# EAGLE design scales (EAGLE 7.3.0)
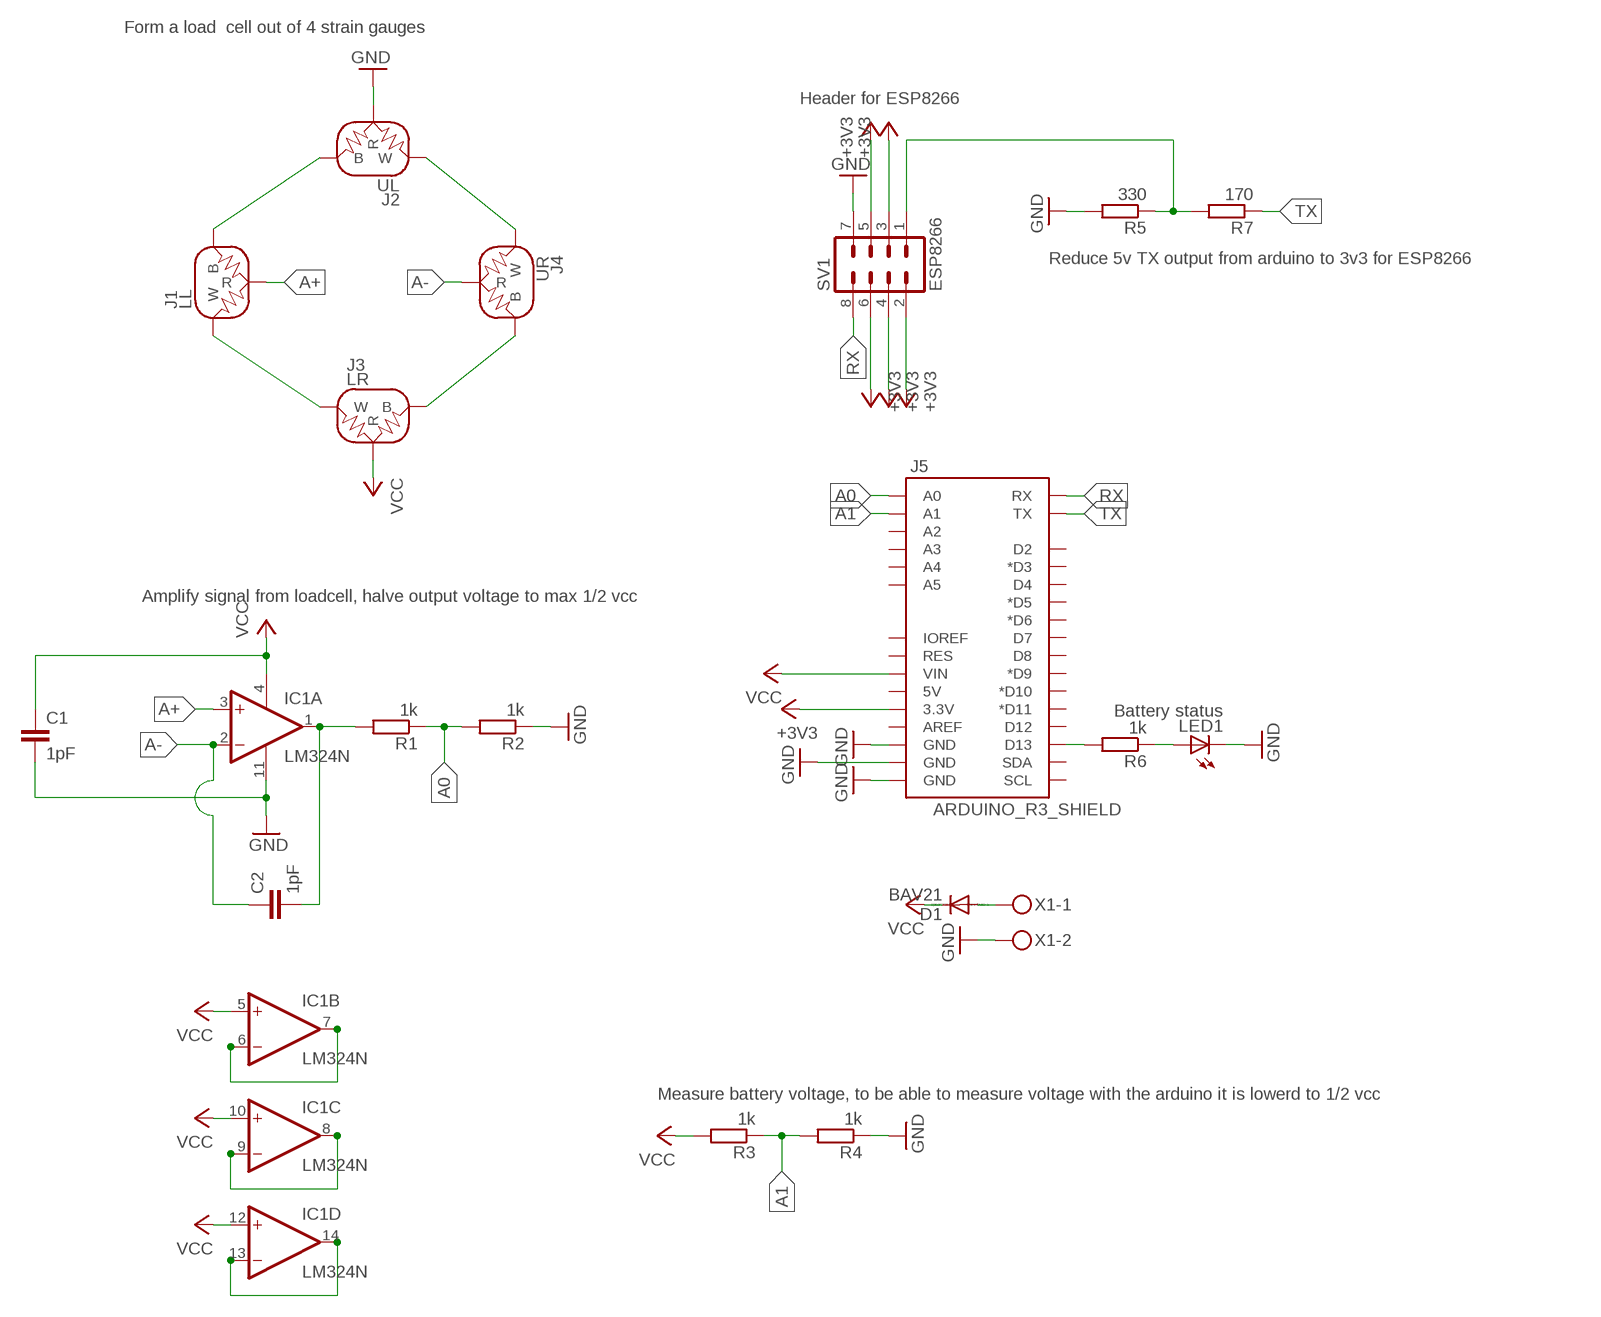
[diagram p0: schematic, sheet 1]

## Parts
C1  1pF  C-EU025-024X044  [C025-024X044]
C2  1pF  C-EU025-024X044  [C025-024X044]
D1  BAV21  [DO35-10]
IC1  LM324N  [DIL14]
J1  LL  LOAD_CELL1X03-PTH  [1X03]
J2  UL  LOAD_CELL1X03-PTH  [1X03]
J3  LR  LOAD_CELL1X03-PTH  [1X03]
J4  UR  LOAD_CELL1X03-PTH  [1X03]
J5  ARDUINO_R3_SHIELD  [UNO_R3_SHIELD]
LED1  Battery status  LED5MM  [LED5MM]
R1  1k  R-EU_0204/5  [0204/5]
R2  1k  R-EU_0204/5  [0204/5]
R3  1k  R-EU_0204/5  [0204/5]
R4  1k  R-EU_0204/5  [0204/5]
R5  330  R-EU_0204/5  [0204/5]
R6  1k  R-EU_0204/5  [0204/5]
R7  170  R-EU_0204/5  [0204/5]
SV1  ESP8266  MA04-2  [MA04-2]
X1  MKDSN1,5/2-5,08  [MKDSN1,5/2-5,08]

## Nets
+3V3: J5.3.3V SV1.2 SV1.3 SV1.4 SV1.5 SV1.6
A0: J5.A0 R1.1 R2.2
A1: J5.A1 R3.1 R4.2
A+: IC1.3(A:+IN) J1.3(R)
A-: C2.1 IC1.2(A:-IN) J4.3(R)
GND: C1.2 IC1.11(P:V-) J2.3(R) J5.GND@0(GND) J5.GND@1(GND) J5.GND@2(GND) LED1.K(C) R2.1 R4.1 R5.2 SV1.7 X1.2
N$1: IC1.6(B:-IN) IC1.7(B:OUT)
N$2: IC1.8(C:OUT) IC1.9(C:-IN)
N$3: IC1.13(D:-IN) IC1.14(D:OUT)
N$4: D1.A X1.1
N$5: J5.D13 R6.2
N$6: C2.2 IC1.1(A:OUT) R1.2
N$7: LED1.A R6.1
N$8: R5.1 R7.2 SV1.1
N$13: J1.1(B) J2.1(B)
N$14: J3.1(B) J4.1(B)
N$15: J2.2(W) J4.2(W)
N$16: J1.2(W) J3.2(W)
RX: J5.RX SV1.8
TX: J5.TX R7.1
VCC: C1.1 D1.C IC1.4(P:V+) IC1.5(B:+IN) IC1.10(C:+IN) IC1.12(D:+IN) J3.3(R) J5.VIN R3.2
Unconnected: J5.5V J5.A2 J5.A3 J5.A4 J5.A5 J5.AREF J5.D2 J5.D3(*D3) J5.D4 J5.D5(*D5) J5.D6(*D6) J5.D7 J5.D8 J5.D9(*D9) J5.D10(*D10) J5.D11(*D11) J5.D12 J5.IOREF J5.RES J5.SCL J5.SDA

## Notes on the sheet
- Form a load  cell out of 4 strain gauges
- Header for ESP8266
- Reduce 5v TX output from arduino to 3v3 for ESP8266
- Amplify signal from loadcell, halve output voltage to max 1/2 vcc
- Measure battery voltage, to be able to measure voltage with the arduino it is lowerd to 1/2 vcc

## Library data of the parts
C1 C2 = rcl:C-EU: CAPACITOR, European symbol
D1 = diode:BAV21: DIODE high-voltage general purpose diode
IC1 = linear:LM324: OP AMP; MF: STMICROELECTRONICS; MPN: LM324AN; OC_FARNELL: 1467654
J1-J4 = SparkFun-Sensors:LOAD_CELL: Half-wheatstone bridge Load Cell; OC_FARNELL: unknown
J5 = SparkFun-Boards:ARDUINO_R3_SHIELD: Shield form compatible with the Arduino Uno R3.; OC_FARNELL: unknown
LED1 = led:LED: LED OSRAM: - CHIPLED LG R971, LG N971, LY N971, LG Q971, LY Q971, LO R971, LY R971 LH N974, LH R974 LS Q976, LO Q976, LY Q976 LO Q996 - Hyper CHIPLED LW Q18S LB Q993, LB Q99A, LB R99A - SideLED LS A670, LO A670, LY A670, LG A670, LP A670 LB A673, LV A673, LT A673, LW A673 LH A674 LY A675 LS A676, LA A676, LO A676, LY A676, LW A676 LS A679, LY A679, LG A679 - Hyper Micro SIDELED® LS Y876, LA Y876, LO Y876, LY Y876 LT Y87S - SmartLED LW L88C, LW L88S LB L89C, LB L89S, LG L890 LS L89K, LO L89K, LY L89K LS L896, LA L896, LO L896, LY L896 - TOPLED LS T670, LO T670, LY T670, LG T670, LP T670 LSG T670, LSP T670, LSY T670, LOP T670, LYG T670 LG T671, LOG T671, LSG T671 LB T673, LV T673, LT T673, LW T673 LH T674 LS T676, LA T676, LO T676, LY T676, LB T676, LH T676, LSB T676, LW T676 LB T67C, LV T67C, LT T67C, LS T67K, LO T67K, LY T67K, LW E67C LS E67B, LA E67B, LO E67B, LY E67B, LB E67C, LV E67C, LT E67C LW T67C LS T679, LY T679, LG T679 LS T770, LO T770, LY T770, LG T770, LP T770 LB T773, LV T773, LT T773, LW T773 LH T774 LS E675, LA E675, LY E675, LS T675 LS T776, LA T776, LO T776, LY T776, LB T776 LHGB T686 LT T68C, LB T68C - Hyper Mini TOPLED® LB M676 - Mini TOPLED Santana® LG M470 LS M47K, LO M47K, LY M47K Source: http://www.osram.convergy.de LUXEON: - LUMILED® LXK2-PW12-R00, LXK2-PW12-S00, LXK2-PW14-U00, LXK2-PW14-V00 LXK2-PM12-R00, LXK2-PM12-S00, LXK2-PM14-U00 LXK2-PE12-Q00, LXK2-PE12-R00, LXK2-PE12-S00, LXK2-PE14-T00, LXK2-PE14-U00 LXK2-PB12-K00, LXK2-PB12-L00, LXK2-PB12-M00, LXK2-PB14-N00, LXK2-PB14-P00, LXK2-PB14-Q00 LXK2-PR12-L00, LXK2-PR12-M00, LXK2-PR14-Q00, LXK2-PR14-R00 LXK2-PD12-Q00, LXK2-PD12-R00, LXK2-PD12-S00 LXK2-PH12-R00, LXK2-PH12-S00 LXK2-PL12-P00, LXK2-PL12-Q00, LXK2-PL12-R00 Source: www.luxeon.com KINGBRIGHT: KA-3528ASYC Source: www.kingbright.com
R1-R7 = resistor:R-EU_: RESISTOR, European symbol; MF: PANASONIC ELECTRONIC COMPONENTS; MPN: ERG1SJ102; OC_FARNELL: 2324488
SV1 = con-lstb:MA04-2: PIN HEADER; MF: GLOBAL CONNECTOR TECHNOLOGY; MPN: BD060-08-A-N-0230-L-G; OC_FARNELL: 1798806; OC_NEWARK: unknown
X1 = con-phoenix-508:MKDSN1,5/2-5,08: MKDSN 1,5/ 2-5,08 Printklemme Nennstrom: 13,5 A Nennspannung: 250 V Rastermaß: 5,08 mm Polzahl: 2 Anschlussart: Schraubanschluss Montage: Löten Anschlussrichtung Leiter/Platine: 0 ° Artikelnummer: 1729128 Source: http://eshop.phoenixcontact.com .. 1729128.pdf

## Net classes
0 default: width 0.305 mm, drill 0.508 mm, clearance 0.254 mm

## Board
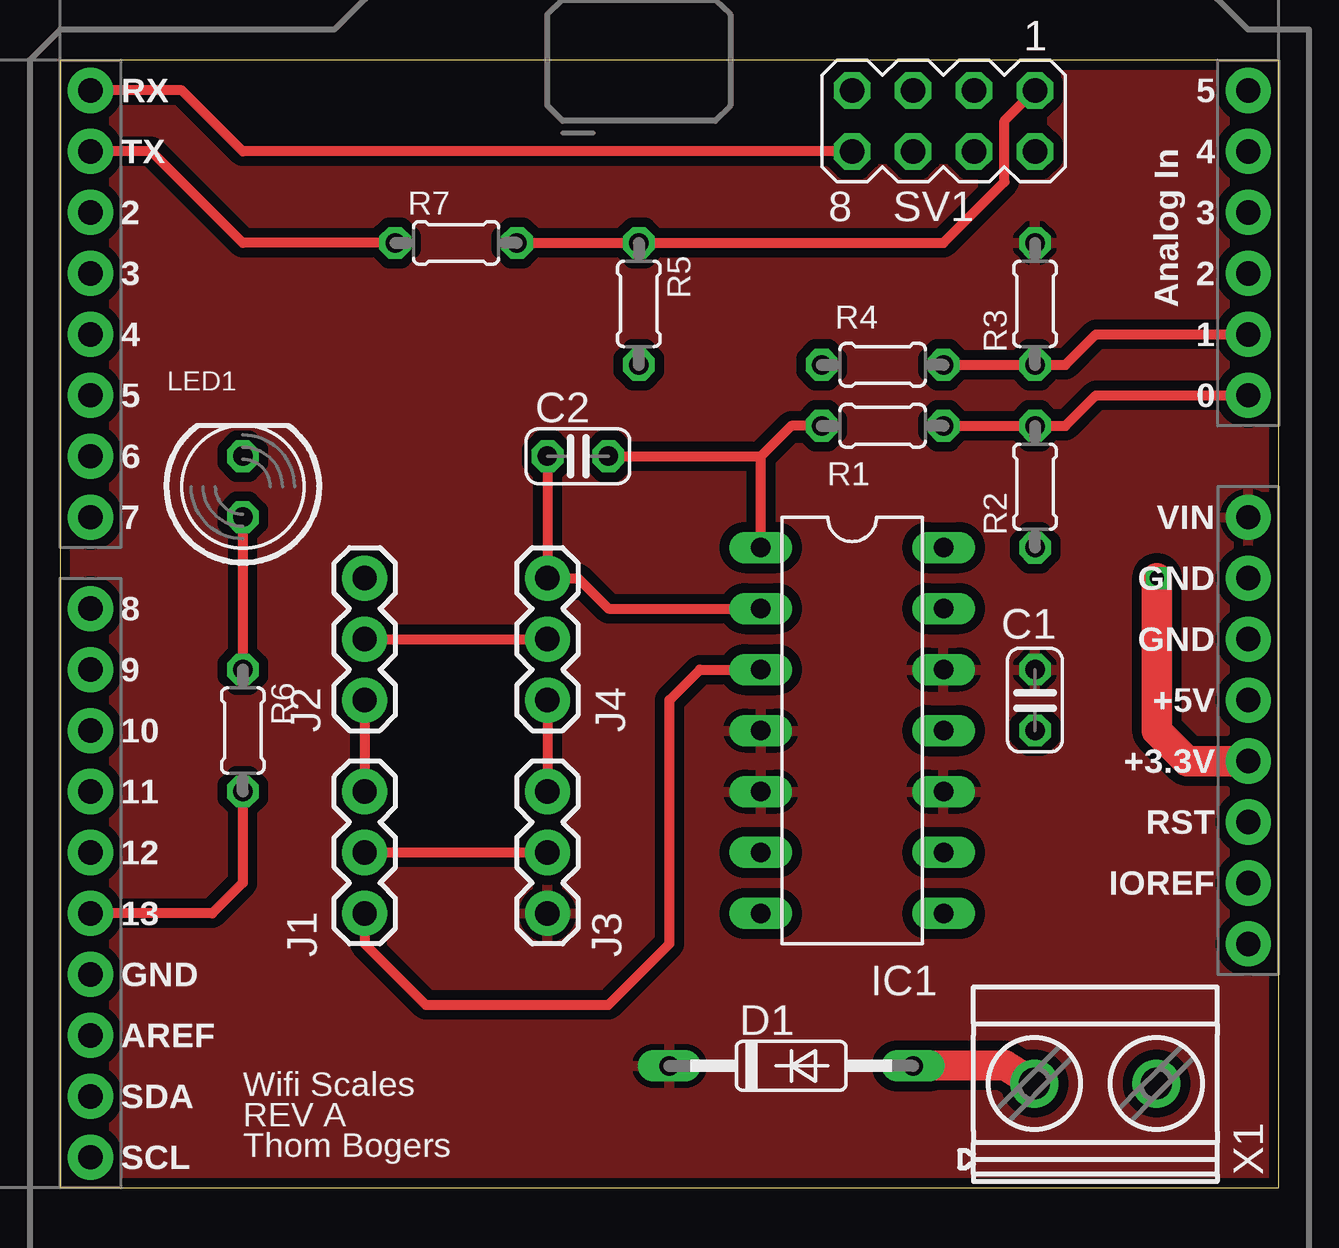
[diagram p1: board, top side]
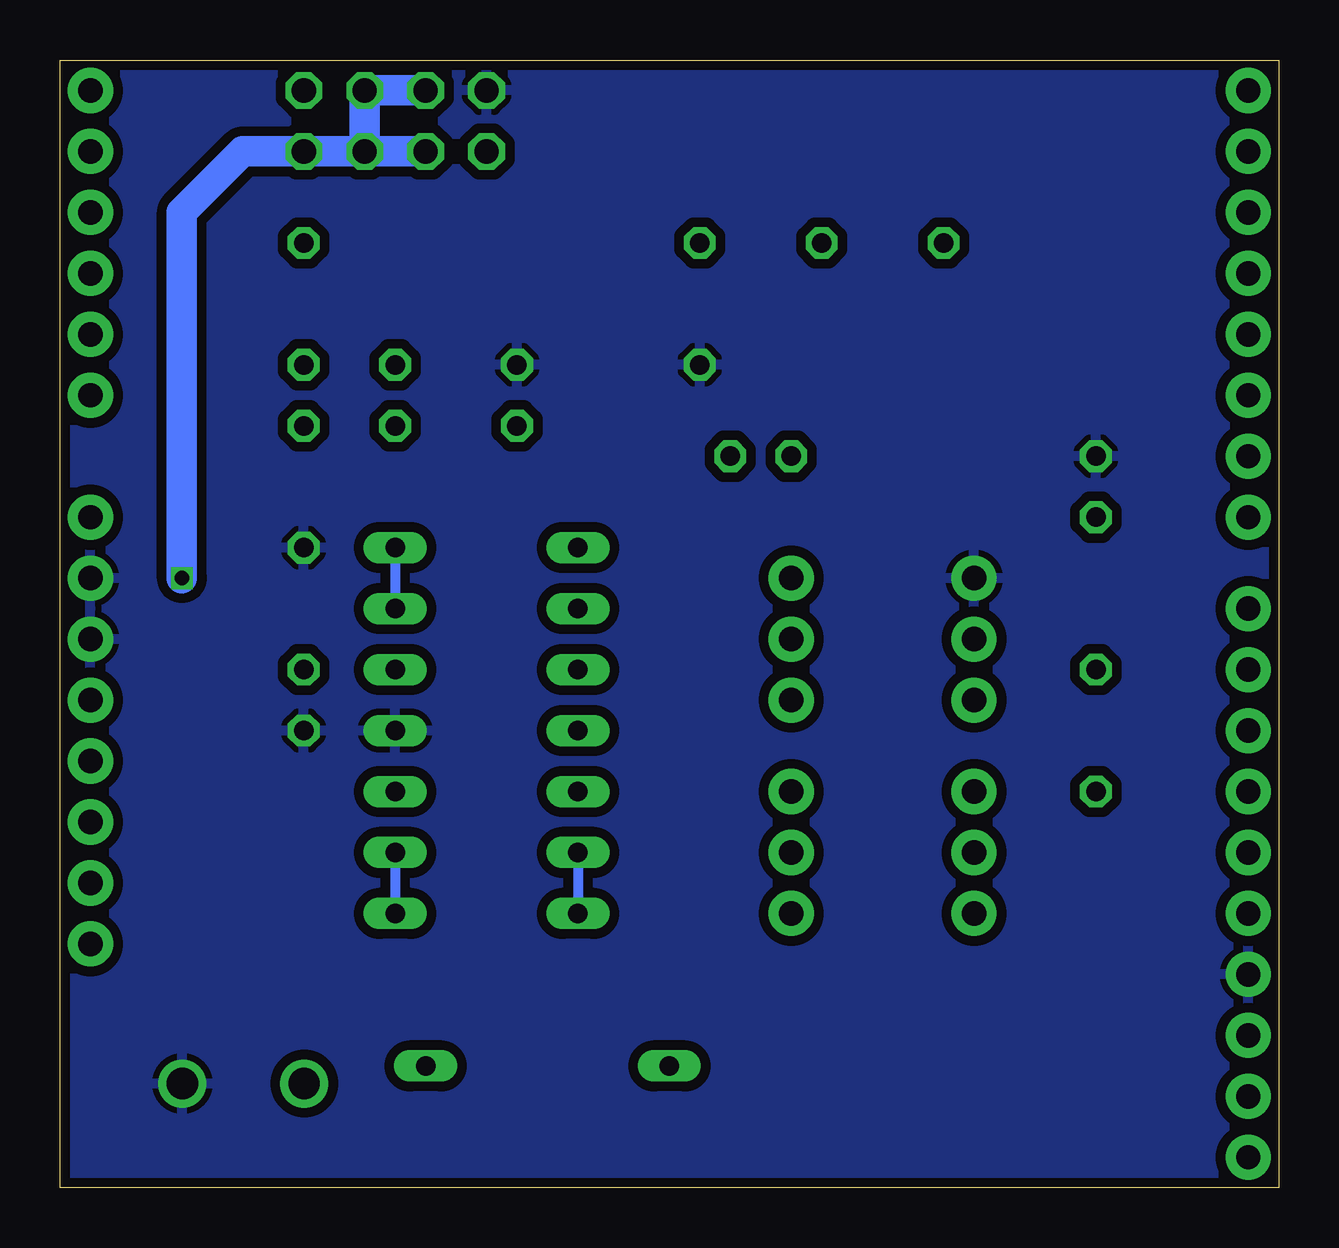
[diagram p2: board, bottom side, seen from below]

Size 50.8 x 46.98 mm. Coordinates in mm from the lower left corner, seen from the top.
Outline: 0,0 50.8,0 50.8,46.98 0,46.98 0,0
Copper layers (1*16): Top 0.035mm / dielectric 1.5mm / Bottom 0.035mm
Design rules "ITead_rule": minimum track width 6mil, minimum drill 12mil, track to track 6mil, track to pad 6mil, pad to pad 6mil, via to via 6mil, smd to smd 0mil, copper to edge 10mil, drill to drill 10mil, minimum pad ring 10mil, minimum via ring 6mil, stop-mask expansion 2mil, vias tented up to drill 100mil, thermal gap 10mil

### Footprints (pad centres in the part's own frame; a part is rotated, then mirrored left to right if it is on the bottom)
C025-024X044 = drill 0.813 octagon: 1 -1.27,0; 2 1.27,0
DO35-10 = drill 0.813 long: A 5.08,0; C -5.08,0
DIL14 = drill 0.813 long: 1 -7.62,-3.81; 2 -5.08,-3.81; 3 -2.54,-3.81; 4 0,-3.81; 5 2.54,-3.81; 6 5.08,-3.81; 7 7.62,-3.81; 8 7.62,3.81; 9 5.08,3.81; 10 2.54,3.81; 11 0,3.81; 12 -2.54,3.81; 13 -5.08,3.81; 14 -7.62,3.81
1X03 = drill 1.016 pad 1.88: 1 0,0; 2 2.54,0; 3 5.08,0
UNO_R3_SHIELD = drill 1.016 pad 1.88: 3.3V 50.8,26.67; 5V 50.8,29.21; A0 50.8,41.91; A1 50.8,44.45; A2 50.8,46.99; A3 50.8,49.53; A4 50.8,52.07; A5 50.8,54.61; AREF 2.54,15.24; D2 2.54,49.53; D3 2.54,46.99; D4 2.54,44.45; D5 2.54,41.91; D6 2.54,39.37; D7 2.54,36.83; D8 2.54,33.02; D9 2.54,30.48; D10 2.54,27.94; D11 2.54,25.4; D12 2.54,22.86; D13 2.54,20.32; GND@0 50.8,31.75; GND@1 50.8,34.29; GND@2 2.54,17.78; IOREF 50.8,21.59; NC 50.8,19.05; RES 50.8,24.13; RX 2.54,54.61; SCL 2.54,10.16; SDA 2.54,12.7; TX 2.54,52.07; VIN 50.8,36.83
LED5MM = drill 0.813 octagon: A -1.27,0; K 1.27,0
0204/5 = drill 0.813 octagon: 1 -2.54,0; 2 2.54,0
MA04-2 = drill 1.016 octagon: 1 -3.81,-1.27; 2 -3.81,1.27; 3 -1.27,-1.27; 4 -1.27,1.27; 5 1.27,-1.27; 6 1.27,1.27; 7 3.81,-1.27; 8 3.81,1.27
MKDSN1,5/2-5,08 = drill 1.3 pad 2: 1 -2.561,0.025; 2 2.519,0.025

### Placement (x,y rotation side)
C1  40.64,20.32 270 top
C2  21.59,30.48 0 top
D1  30.48,5.08 0 top
IC1  33.02,19.05 270 top
J1  12.7,16.51 270 top
J2  12.7,20.32 90 top
J3  20.32,16.51 270 top
J4  20.32,20.32 90 top
J5  -1.27,-8.89 0 top
LED1  7.62,29.21 90 top
R1  34.29,31.75 180 top
R2  40.64,29.21 90 top
R3  40.64,36.83 90 top
R4  34.29,34.29 0 top
R5  24.13,36.83 270 top
R6  7.62,19.05 270 top
R7  16.51,39.37 0 top
SV1  36.83,44.45 180 top
X1  43.18,4.32 0 top

### Tracks (layer width: path | path; a pad name or v marks a point on that pad's centre or on a via)
+3V3  (via drill 0.6)
  Top 1.27: J5.3.3V 46.99,17.78 45.72,19.05 v45.72,25.4
  Bottom 1.27: SV1.4 SV1.6 | SV1.4 SV1.3 SV1.5 | SV1.4 SV1.2 43.18,43.18 45.72,40.64 v45.72,25.4
A0
  Top 0.406: R1.1 R2.2 41.91,31.75 43.18,33.02 J5.A0
A1
  Top 0.406: R4.2 R3.1 41.91,34.29 43.18,35.56 J5.A1
A+
  Top 0.406: J1.3 12.7,10.16 15.24,7.62 22.86,7.62 25.4,10.16 25.4,20.32 26.67,21.59 IC1.3
A-
  Top 0.406: IC1.2 22.86,24.13 21.59,25.4 J4.3 C2.1
GND
  pour Bottom (isolate 0.406): 0,46.99 0,0 50.8,0 50.8,46.99
N$1
  Bottom 0.406: IC1.6 IC1.7
N$2
  Bottom 0.406: IC1.9 IC1.8
N$3
  Bottom 0.406: IC1.14 IC1.13
N$4
  Top 1.27: X1.1 39.39,5.1 D1.A
N$5
  Top 0.406: R6.2 7.62,12.7 6.35,11.43 J5.D13
N$6
  Top 0.406: IC1.1 29.21,30.48 | R1.2 30.48,31.75 29.21,30.48 | C2.2 29.21,30.48
N$7
  Top 0.406: LED1.A R6.1
N$8
  Top 0.406: R7.2 R5.1 36.83,39.37 39.37,41.91 39.37,44.45 SV1.1
N$13
  Top 0.406: J2.1 J1.1
N$14
  Top 0.406: J4.1 J3.1
N$15
  Top 0.406: J2.2 J4.2
N$16
  Top 0.406: J1.2 J3.2
RX
  Top 0.406: SV1.8 7.62,43.18 5.08,45.72 J5.RX
TX
  Top 0.406: R7.1 7.62,39.37 3.81,43.18 J5.TX
VCC
  pour Top (isolate 0.406): 0,46.99 0,0 50.8,0 50.8,46.99

### Text on the board
tPlace: Wifi Scales | REV A | Thom Bogers